# Altium schematic sheet CCHub Breakout.SchDoc
size 431 x 279 mm; SheetNumber: 1; SheetTotal: 1
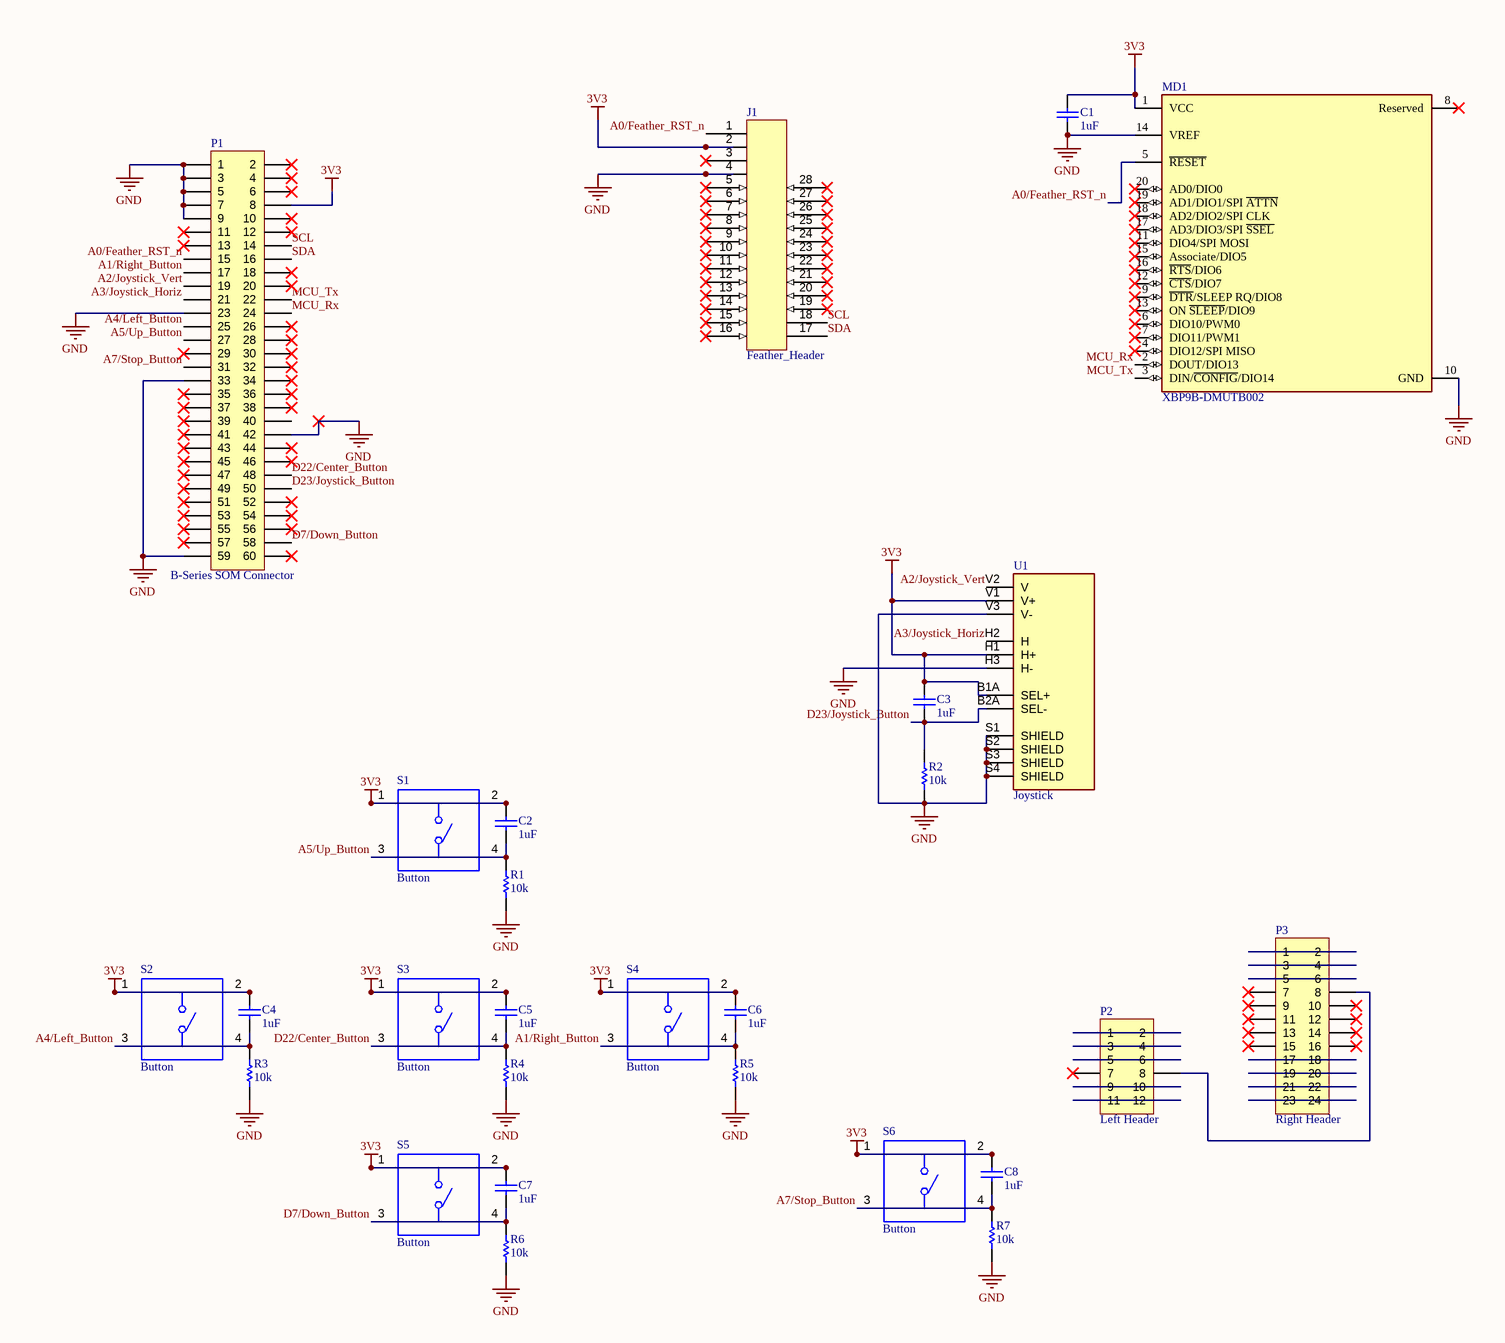
[diagram p0: CCHub Breakout.SchDoc]

## Parts
C1  value 1uF  [1206 Capacitor]  (hidden comment: Capacitor)
C2  value 1uF  [1206 Capacitor]  (hidden comment: Capacitor)
C3  value 1uF  [1206 Capacitor]  (hidden comment: Capacitor)
C4  value 1uF  [1206 Capacitor]  (hidden comment: Capacitor)
C5  value 1uF  [1206 Capacitor]  (hidden comment: Capacitor)
C6  value 1uF  [1206 Capacitor]  (hidden comment: Capacitor)
C7  value 1uF  [1206 Capacitor]  (hidden comment: Capacitor)
C8  value 1uF  [1206 Capacitor]  (hidden comment: Capacitor)
J1  Feather_Header  [Feather_OLED]
MD1  XBP9B-DMUTB002  [FP-XBP9B-DMUTB002-MFG]
P1  B-Series SOM Connector  [HDR2X30]
P2  Left Header  [HDR2X6]
P3  Right Header  [HDR2X12]
R1  value 10k  [1206 Resistor]  (hidden comment: Resistor)
R2  value 10k  [1206 Resistor]  (hidden comment: Resistor)
R3  value 10k  [1206 Resistor]  (hidden comment: Resistor)
R4  value 10k  [1206 Resistor]  (hidden comment: Resistor)
R5  value 10k  [1206 Resistor]  (hidden comment: Resistor)
R6  value 10k  [1206 Resistor]  (hidden comment: Resistor)
R7  value 10k  [1206 Resistor]  (hidden comment: Resistor)
S1  Button  [Makerspace Button]
S2  Button  [Makerspace Button]
S3  Button  [Makerspace Button]
S4  Button  [Makerspace Button]
S5  Button  [Makerspace Button]
S6  Button  [Makerspace Button]
U1  Joystick  [XDCR_COM-09032]

## Nets
3V3: C1.2 C2.2 C3.2 C4.2 C5.2 C6.2 C7.2 C8.2 J1.2 MD1.1(VCC) P1.8 S1.1 S1.2 S2.1 S2.2 S3.1 S3.2 S4.1 S4.2 S5.1 S5.2 S6.1 S6.2 U1.B1A(SEL+) U1.H1(H+) U1.V1(V+)
GND: C1.1 J1.4 MD1.10(GND) MD1.14(VREF) P1.1 P1.3 P1.5 P1.7 P1.9 P1.23 P1.33 P1.42 P1.59 R1.1 R2.1 R3.1 R4.1 R5.1 R6.1 R7.1 U1.H3(H-) U1.S1(SHIELD) U1.S2(SHIELD) U1.S3(SHIELD) U1.S4(SHIELD) U1.V3(V-)
A0/Feather_RST_n: J1.1 MD1.5(~{RESET}) P1.15
A1/Right_Button: C6.1 P1.17 R5.2 S4.3 S4.4
A2/Joystick_Vert: P1.19 U1.V2(V)
A3/Joystick_Horiz: P1.21 U1.H2(H)
A4/Left_Button: C4.1 P1.25 R3.2 S2.3 S2.4
A5/Up_Button: C2.1 P1.27 R1.2 S1.3 S1.4
A7/Stop_Button: C8.1 P1.31 R7.2 S6.3 S6.4
D7/Down_Button: C7.1 P1.58 R6.2 S5.3 S5.4
D22/Center_Button: C5.1 P1.48 R4.2 S3.3 S3.4
D23/Joystick_Button: C3.1 P1.50 R2.2 U1.B2A(SEL-)
MCU_Rx: MD1.2(DOUT/DIO13) P1.24
MCU_Tx: MD1.3(DIN/~{CONFIG}/DIO14) P1.22
SCL: J1.18 P1.14
SDA: J1.17 P1.16
NetP2_1: P2.1 P2.2
NetP2_3: P2.3 P2.4
NetP2_5: P2.5 P2.6
NetP2_8: P2.8 P3.8
NetP2_9: P2.9 P2.10
NetP2_11: P2.11 P2.12
NetP3_1: P3.1 P3.2
NetP3_3: P3.3 P3.4
NetP3_5: P3.5 P3.6
NetP3_17: P3.17 P3.18
NetP3_19: P3.19 P3.20
NetP3_21: P3.21 P3.22
NetP3_23: P3.23 P3.24

Not connected (* = marked no-connect by the designer): J1 3* 5* 6* 7* 8* 9* 10* 11* 12* 13* 14* 15* 16* 19* 20* 21* 22* 23* 24* 25* 26* 27* 28*; MD1 4(DIO12/SPI_MISO)* 6(DIO10/PWM0)* 7(DIO11/PWM1)* 8(Reserved)* 9(~{DTR}/SLEEP_RQ/DIO8)* 11(DIO4/SPI_MOSI)* 12(~{CTS}/DIO7)* 13(ON_~{SLEEP}/DIO9)* 15(Associate/DIO5)* 16(~{RTS}/DIO6)* 17(AD3/DIO3/SPI_~{SSEL})* 18(AD2/DIO2/SPI_CLK)* 19(AD1/DIO1/SPI_~{ATTN})* 20(AD0/DIO0)*; P1 2* 4* 6* 10* 11* 12* 13* 18* 20* 26* 28* 29* 30* 32* 34* 35* 36* 37* 38* 39* 40 41* 43* 44* 45* 46* 47* 49* 51* 52* 53* 54* 55* 56* 57* 60*; P2 7*; P3 7* 9* 10* 11* 12* 13* 14* 15* 16*

## Notes on the sheet
- DWG. NO.
- REV.
- SHT.
- THIS DOCUMENT AND THE DATA DISCLOSED HEREIN OR HEREWITH IS THE PROPERTY OF ALTIUM LIMITED AND MAY BE FREELY DISTRIBUTED IN WHOLE. NO RIGHTS ARE RESERVED OR EXPRESS OR IMPLIED WARANTEE GIVEN.
- REVISION
- DESCRIPTION
- DATE
- APPROVED
- ENG:
- APPROVALS
- PROJECT
- DSN:
- CHK:
- REFERENCE DOCUMENTS
- PROJECT REVISION:
- TITLE
- DOCUMENT REVISION:
- DESIGN ITEM:
- BOM:
- FAB DWG:
- PCB DWG:
- ASSY DWG:
- SCALE:
- SIZE
- B
- CAGE CODE
- FILE NAME
- DWG NO.
- SHEET
- OF
- REV

## Library data of the parts
C1-C8 = Capacitor: SimulationGenericComponent: True
MD1 = CMP-84319-000004-1: RX TXRX MOD ISM < 1GHZ U.FL TH; Max Supply Voltage: 3.6V; Current - Transmitting: 215mA; Sensitivity: -101dBm; Min Frequency: 902MHz; Memory Size: 2KB; Max Frequency: 928MHz; Min Supply Voltage: 2.4V; Current - Receiving: 29mA; Interface: SPI; Data Rate: 200Kbps; Frequency: 900MHz; Output Power (dBm): 24dBm; Number of Pins: 20; Series: XBee-Pro™; Max Operating Temperature: 85°C; Radiation Hardening: No; Min Operating Temperature: -40°C; Package Quantity: 1; RAM Size: 2KB; Packaging: Bulk; Case/Package: Module
P1 = Header 30X2: Header, 30-Pin, Dual row; LatestRevisionDate: 17-Jul-2002; LatestRevisionNote: Re-released for DXP Platform.; Publisher: Altium Limited
P2 = Header 6X2: Header, 6-Pin, Dual row; LatestRevisionDate: 17-Jul-2002; LatestRevisionNote: Re-released for DXP Platform.; Publisher: Altium Limited
P3 = Header 12X2: Header, 12-Pin, Dual row; LatestRevisionDate: 17-Jul-2002; LatestRevisionNote: Re-released for DXP Platform.; Publisher: Altium Limited
R1-R7 = Resistor: TC1: 0; SimulationGenericComponent: True; TC2: 0
S1-S6 = TS02-66-170-BK-260-SCR-D: 6 x 6 mm, 17 mm Actuator Height, 260 gf, Black, Short Crimped, Through Hole, SPST, Tactile Switch; MF: CUI Devices; MP: TS02-66-170-BK-260-SCR-D; Price: None; Availability: In Stock; CUI_purchase_URL: https://www.cuidevices.com/product/switches/tactile-switches/ts02-series?utm_source=snapeda.com&utm_medium=referral&utm_campaign=snapedaBOM; Value: *; Purchase-URL: https://pricing.snapeda.com/search/part/TS02-66-170-BK-260-SCR-D/?ref=eda; Package: None
U1 = COM-09032: Thumb Joystick; Price: None; Package: None; Availability: Unavailable; MP: COM-09032; Value: *